# Altium schematic sheet Programmer.SchDoc: Top
size A4; SheetNumber: 1; SheetTotal: 1
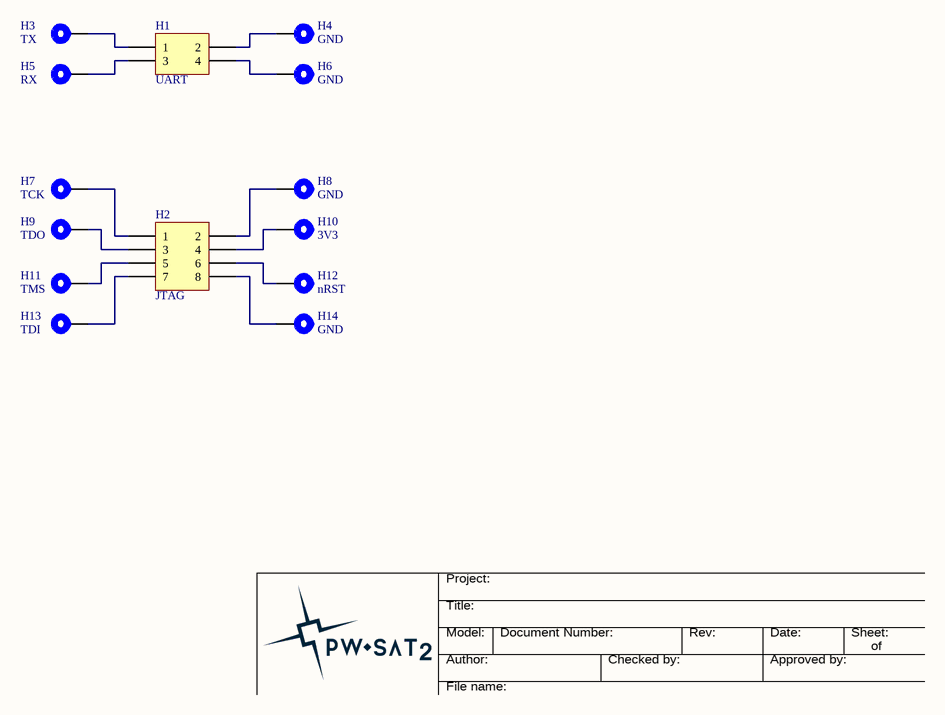
[diagram p0: Programmer.SchDoc]

## Parts
H1  UART  [Connfly_DS1065-03-2X2]
H2  JTAG  [Connfly_DS1065-03-2X4]
H3  TX  [Wire_AWG-30]
H4  GND  [Wire_AWG-30]
H5  RX  [Wire_AWG-30]
H6  GND  [Wire_AWG-30]
H7  TCK  [Wire_AWG-30]
H8  GND  [Wire_AWG-30]
H9  TDO  [Wire_AWG-30]
H10  3V3  [Wire_AWG-30]
H11  TMS  [Wire_AWG-30]
H12  nRST  [Wire_AWG-30]
H13  TDI  [Wire_AWG-30]
H14  GND  [Wire_AWG-30]

## Nets
NetH1_1: H1.1 H3.1
NetH1_2: H1.2 H4.1
NetH1_3: H1.3 H5.1
NetH1_4: H1.4 H6.1
NetH2_1: H2.1 H7.1
NetH2_2: H2.2 H8.1
NetH2_3: H2.3 H9.1
NetH2_4: H2.4 H10.1
NetH2_5: H2.5 H11.1
NetH2_6: H2.6 H12.1
NetH2_7: H2.7 H13.1
NetH2_8: H2.8 H14.1

## Notes on the sheet
- Title:
- Project:
- Author:
- Model:
- Document Number:
- Checked by:
- Rev:
- Date:
- Approved by:
- Sheet:
- of
- File name:

## Library data of the parts
H1 = Header 2X2: Header, 2-Pin, Dual row; LatestRevisionDate: 17-Jul-2002; LatestRevisionNote: Re-released for DXP Platform.; Publisher: Altium Limited
H2 = Header 4X2: Header, 4-Pin, Dual row; LatestRevisionDate: 17-Jul-2002; LatestRevisionNote: Re-released for DXP Platform.; Publisher: Altium Limited
H3-H14 = Wire_AWG-30: An AWG-30 wire solder point.